# EAGLE design forTQFPAdapter (EAGLE 7.7.0)
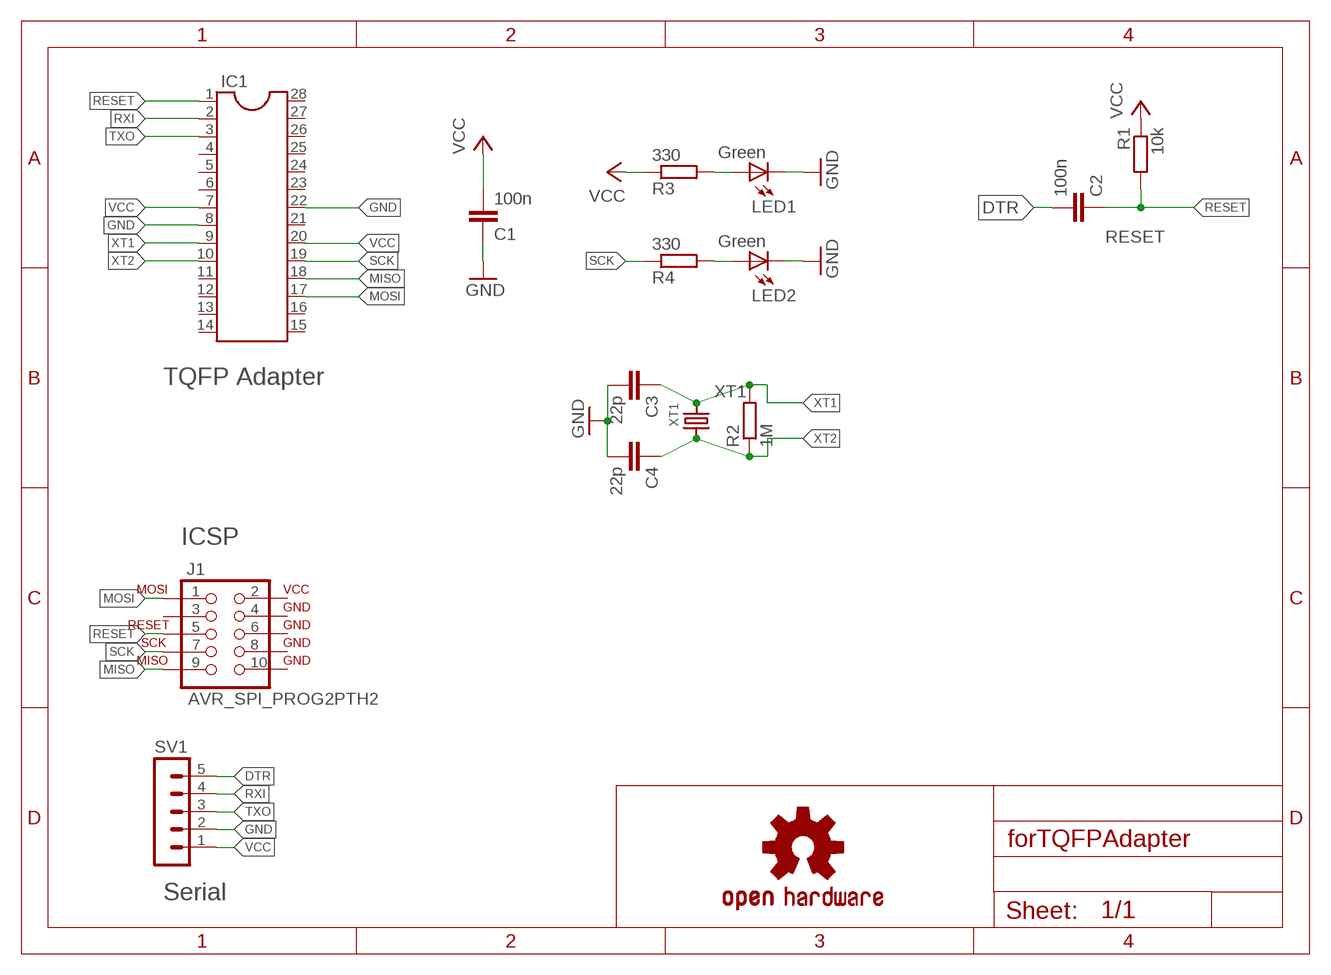
[diagram p0: schematic, sheet 1]

## Parts
C1  100n  C-EUC0805K  [C0805K]
C2  100n  C-EUC0805K  [C0805K]
C3  22p  C-EUC0805K  [C0805K]
C4  22p  C-EUC0805K  [C0805K]
IC1  DIL28  [DIL28-6]
J1  AVR_SPI_PROG2PTH2  [2X5-SHROUDED]
LED1  Green  LED1206  [LED-1206]
LED2  Green  LED1206  [LED-1206]
LOGO1  OSHW-LOGOM  [OSHW-LOGO-M]
R1  10k  R-EU_M0805  [M0805]
R2  1M  R-EU_M0805  [M0805]
R3  330  R-EU_M0805  [M0805]
R4  330  R-EU_M0805  [M0805]
SV1  MA05-1  [MA05-1]
XT1  CRYSTAL  [HC49]

## Nets
DTR: C2.2 SV1.5
GND: C1.1 C3.2 C4.2 IC1.8 IC1.22 LED1.C LED2.C SV1.2
MISO: IC1.18 J1.9(MISO)
MOSI: IC1.17 J1.1(MOSI)
N$1: LED2.A R4.2
N$7: LED1.A R3.2
RESET: C2.1 IC1.1 J1.5(RESET) R1.2
RXI: IC1.2 SV1.4
SCK: IC1.19 J1.7(SCK) R4.1
TXO: IC1.3 SV1.3
VCC: C1.2 IC1.7 IC1.20 R1.1 R3.1 SV1.1
XT1: C3.1 IC1.9 R2.2 XT1.11 XT1.12
XT2: C4.1 IC1.10 R2.1 XT1.21 XT1.22
Unconnected: IC1.4 IC1.5 IC1.6 IC1.11 IC1.12 IC1.13 IC1.14 IC1.15 IC1.16 IC1.21 IC1.23 IC1.24 IC1.25 IC1.26 IC1.27 IC1.28 J1.3(NC)

## Notes on the sheet
- TQFP Adapter
- ICSP
- Serial

## Power pins joined to a net without a drawn wire
GND: J1.4(GND) J1.6(GND) J1.8(GND) J1.10(GND)
VCC: J1.2(VCC)

## Library data of the parts
C1-C4 = rcl:C-EU: CAPACITOR, European symbol
IC1 = ic-package:DIL28: Dual In Line
J1 = SparkFun-Connectors:AVR_SPI_PROG2: AVR 10-pin ICSP Header This is the standard AVR In Circuit Serial Programming header. Minimal, but includes pin one indicator. Works with standard Olimex programmers. Also look for the 6-pin reduced version. Spark Fun Electronics SKU: PRT-00778
LED1 LED2 = Testing:LED: LEDs Standard schematic elements and footprints for 5mm, 3mm, 1206, and 0603 sized LEDs. 5mm - Spark Fun Electronics SKU : COM-00529 (and others)
LOGO1 = SparkFun-Aesthetics:OSHW-LOGO: Open-Source Hardware (OSHW) Logo This logo indicates the piece of hardware it is found on incorporates a OSHW license and/or adheres to the definition of open source hardware found here: http://freedomdefined.org/OSHW
R1-R4 = rcl:R-EU_: RESISTOR, European symbol
SV1 = con-lstb:MA05-1: PIN HEADER; OC_FARNELL: unknown; OC_NEWARK: unknown
XT1 = hazar:CRYSTAL: HC49 Crystal - SMD and through hole combined For providing assembly options

## Board
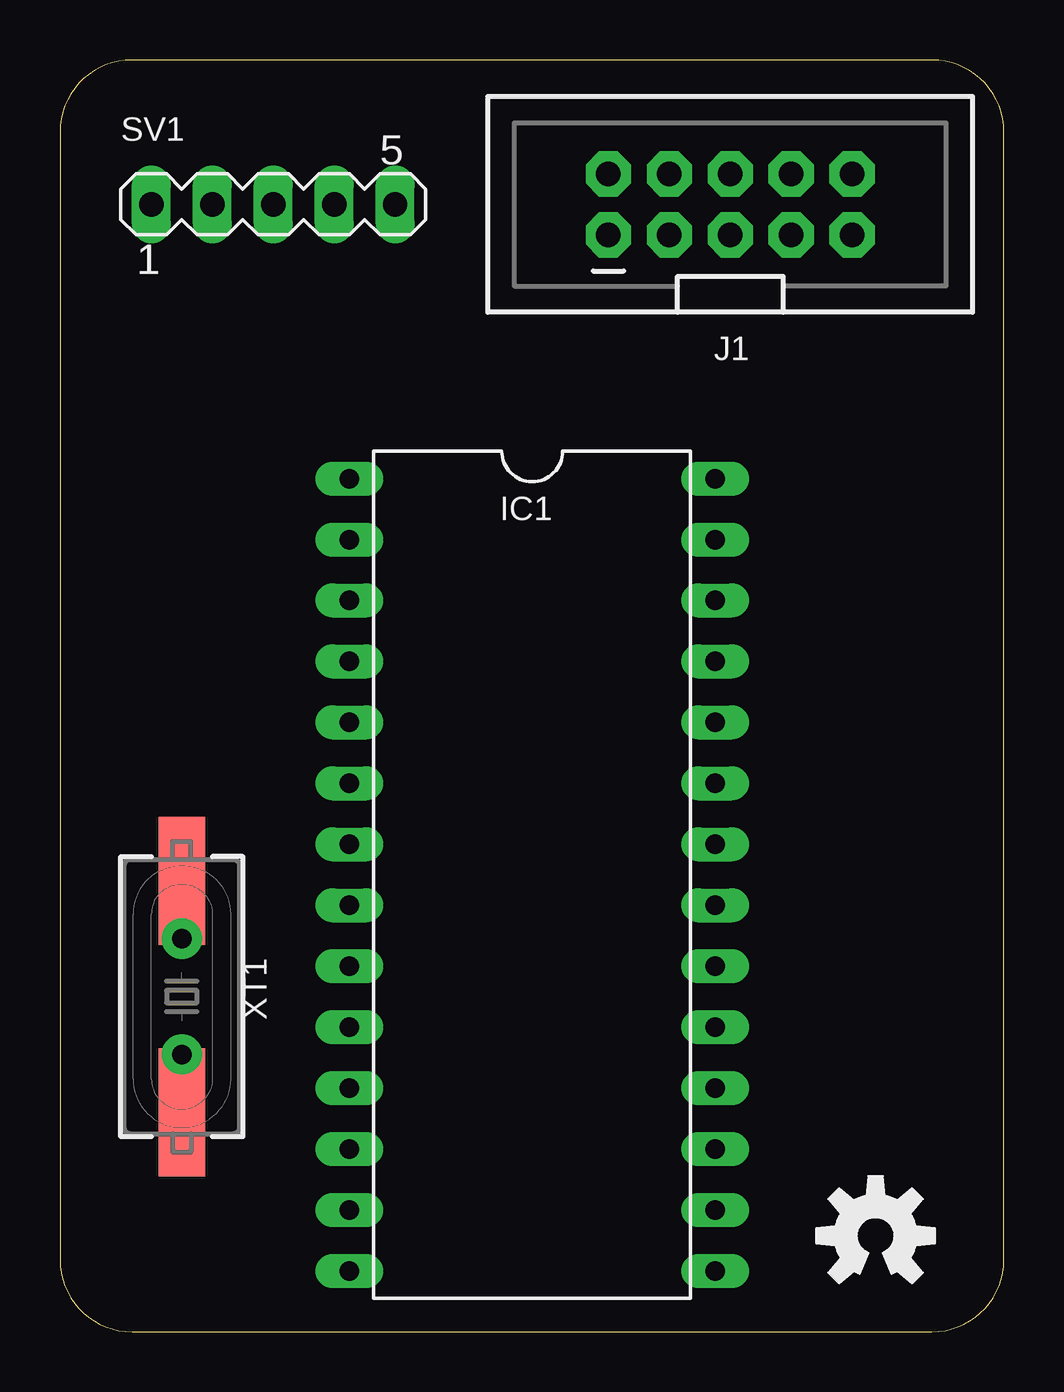
[diagram p1: board, top side]
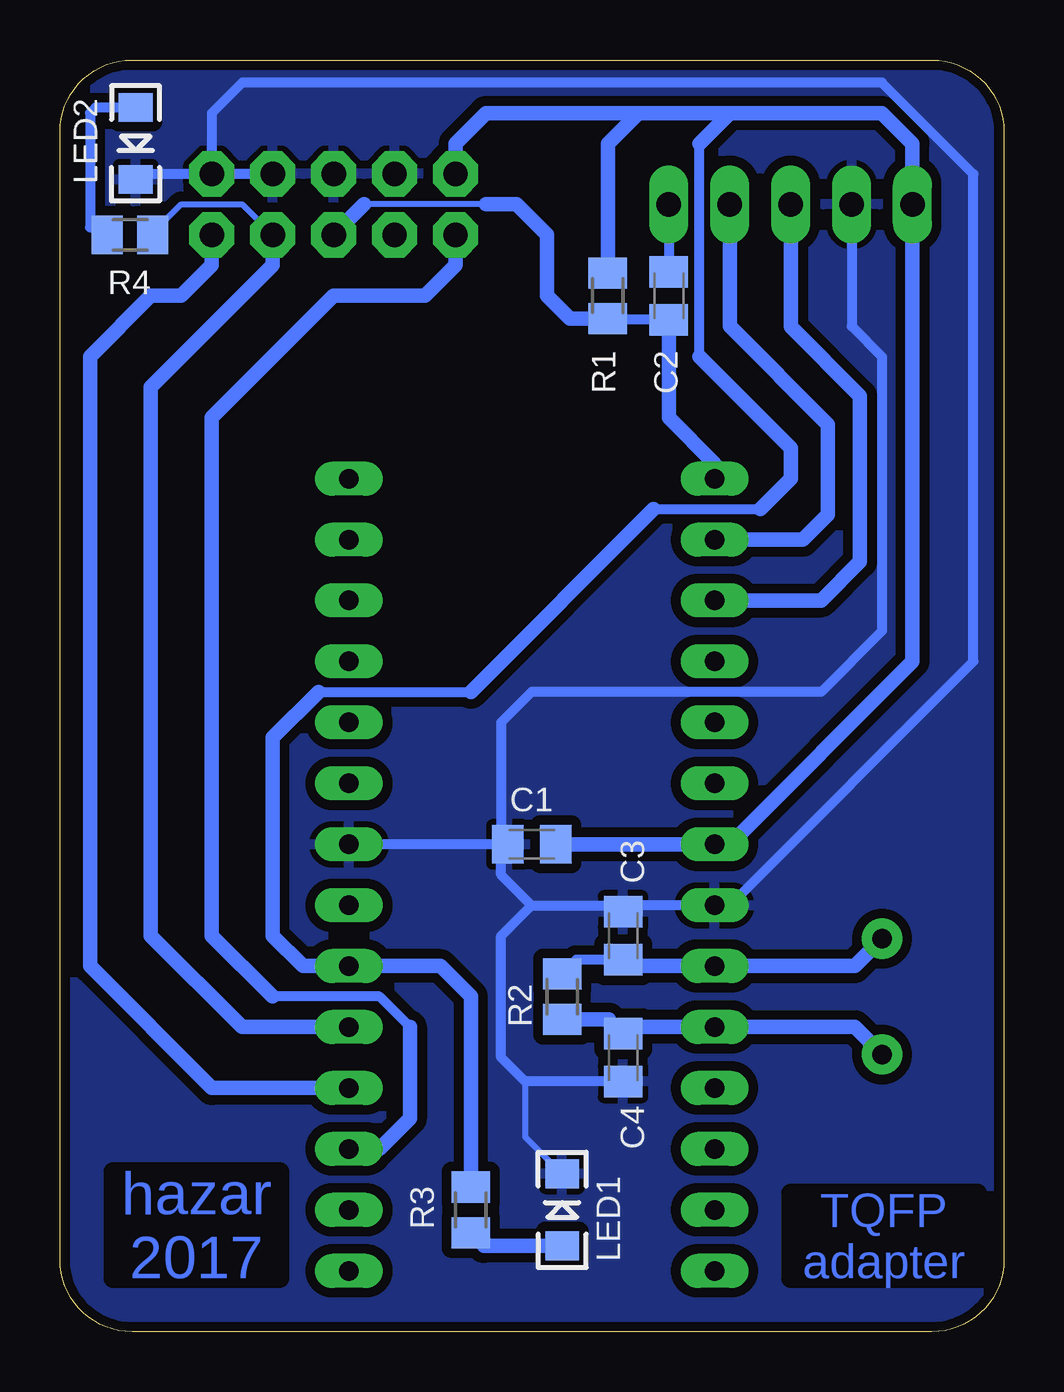
[diagram p2: board, bottom side, seen from below]

Size 39.35 x 53.01 mm. Coordinates in mm from the lower left corner, seen from the top.
Outline: 0,50.01 0,3 arc90 3,0 36.35,0 arc90 39.35,3 39.35,50.01 arc90 36.35,53.01 3,53.01 arc90 0,50.01
Copper layers (1*16): Top 0.035mm / dielectric 1.5mm / Bottom 0.035mm
Design rules "hazar": minimum track width 6mil, minimum drill 13mil, track to track 8mil, track to pad 8mil, pad to pad 8mil, via to via 8mil, smd to smd 8mil, copper to edge 15mil, drill to drill 8mil, minimum pad ring 12mil, minimum via ring 10mil, stop-mask expansion 4mil, vias tented up to drill 25mil, thermal gap 10mil

### Footprints (pad centres in the part's own frame; a part is rotated, then mirrored left to right if it is on the bottom)
C0805K = smd 1.3 x 1.6: 1 -1,0; 2 1,0
DIL28-6 = drill 0.813 long: 1 -16.51,-7.62; 2 -13.97,-7.62; 3 -11.43,-7.62; 4 -8.89,-7.62; 5 -6.35,-7.62; 6 -3.81,-7.62; 7 -1.27,-7.62; 8 1.27,-7.62; 9 3.81,-7.62; 10 6.35,-7.62; 11 8.89,-7.62; 12 11.43,-7.62; 13 13.97,-7.62; 14 16.51,-7.62; 15 16.51,7.62; 16 13.97,7.62; 17 11.43,7.62; 18 8.89,7.62; 19 6.35,7.62; 20 3.81,7.62; 21 1.27,7.62; 22 -1.27,7.62; 23 -3.81,7.62; 24 -6.35,7.62; 25 -8.89,7.62; 26 -11.43,7.62; 27 -13.97,7.62; 28 -16.51,7.62
2X5-SHROUDED = drill 1.016 pad 1.88 octagon: 1 -1.27,5.08; 2 1.27,5.08; 3 -1.27,2.54; 4 1.27,2.54; 5 -1.27,0; 6 1.27,0; 7 -1.27,-2.54; 8 1.27,-2.54; 9 -1.27,-5.08; 10 1.27,-5.08
LED-1206 = smd 1.2 x 1.4: A -1.5,0; C 1.5,0
M0805 = smd 1.3 x 1.6: 1 -0.95,0; 2 0.95,0
MA05-1 = drill 1.016 long: 1 -5.08,0; 2 -2.54,0; 3 0,0; 4 2.54,0; 5 5.08,0
HC49 = smd 5.334 x 1.93: 11 -4.826,0; 22 4.826,0 | drill 0.813 pad 1.676: 12 -2.413,0; 21 2.413,0

### Placement (x,y rotation side)
C1  19.68,20.32 0 bottom
C2  13.97,43.18 90 bottom
C3  15.88,16.51 90 bottom
C4  15.88,11.43 270 bottom
IC1  19.68,19.05 270 top
J1  27.94,46.99 90 top
LED1  18.41,5.08 90 bottom
LED2  36.2,49.53 270 bottom
LOGO1  34,4 0 top
R1  16.51,43.18 270 bottom
R2  18.41,13.97 90 bottom
R3  22.23,5.08 270 bottom
R4  36.43,45.72 180 bottom
SV1  8.89,46.99 0 top
XT1  5.08,13.97 270 top

### Tracks (layer width: path | path; a pad name or v marks a point on that pad's centre or on a via)
DTR
  Bottom 0.406: SV1.5 C2.2
GND
  Bottom 0.254: 19.95,10.43 19.95,8.12 LED1.C
  Bottom 0.406: C4.2 19.95,10.43 20.95,11.43 20.95,16.51 19.68,17.78 | 19.68,17.78 16.14,17.78 C3.2 15.61,17.78 IC1.8 11.43,17.78 1.27,27.94 1.27,48.26 5.08,52.07 31.75,52.07 33.02,50.8 J1.10 | C1.1 IC1.22 | 19.68,17.78 20.95,19.05 20.95,20.05 C1.1 | SV1.2 6.35,41.91 5.08,40.64 5.08,29.21 7.62,26.67 19.68,26.67 20.95,25.4 20.95,20.59 C1.1 | J1.8 J1.10 | J1.10 35.97,48.26 LED2.C
  pour Bottom (isolate 0.406): -1,54 41,54 41,-2 -1,-2
MISO
  Bottom 0.61: J1.9 33.02,44.45 34.29,43.18 35.56,43.18 38.1,40.64 38.1,15.24 33.02,10.16 IC1.18
MOSI
  Bottom 0.406: 24.77,12.7 26.04,13.97 30.48,13.97 | 26.04,7.62 IC1.17
  Bottom 0.61: J1.1 22.86,44.45 24.13,43.18 27.94,43.18 33.02,38.1 33.02,16.51 30.48,13.97 | 24.77,12.7 24.77,8.89 26.04,7.62
N$1
  Bottom 0.406: LED2.A 37.87,51.03 38.1,50.8 38.1,46.04 R4.2
N$7
  Bottom 0.254: 21.68,3.58 R3.2
  Bottom 0.61: LED1.A 21.68,3.58
RESET
  Bottom 0.254: 21.59,46.99 26.67,46.99
  Bottom 0.406: C2.1 16.46,42.18 R1.2
  Bottom 0.61: R1.2 18.1,42.23 19.05,43.18 19.05,45.72 20.32,46.99 21.59,46.99 | 26.67,46.99 J1.5 | IC1.1 12.06,36.2 13.97,38.1 C2.1
RXI
  Bottom 0.61: IC1.2 8.38,33.02 7.34,34.06 7.34,37.82 11.43,41.91 SV1.4
SCK
  Bottom 0.254: R4.1 35.56,45.72 34.29,46.99 31.75,46.99 J1.7
  Bottom 0.61: J1.7 30.48,44.45 35.56,39.37 35.56,16.51 31.75,12.7 IC1.19
TXO
  Bottom 0.61: IC1.3 7.62,30.48 6,32.1 6,39 8.89,41.89 8.89,41.91 SV1.3
VCC
  Bottom 0.254: 23.5,15.24 IC1.20
  Bottom 0.406: 28.57,26.67 22.23,26.67 | 12.7,40.64 12.7,49.53 | 14.61,34.29 10.16,34.29 | 11.43,20.32 IC1.7
  Bottom 0.61: 11.43,50.8 5.08,50.8 3.81,49.53 SV1.1 3.81,27.94 11.43,20.32 | 11.43,50.8 15.24,50.8 | 15.24,50.8 21.59,50.8 22.86,49.53 J1.2 | R1.1 16.51,49.53 15.24,50.8 | IC1.7 C1.2 | 22.23,26.67 14.61,34.29 | 12.7,49.53 11.43,50.8 | R3.1 22.23,13.97 23.5,15.24 29.21,15.24 30.48,16.51 30.48,24.77 28.57,26.67 | 10.16,34.29 8.89,35.56 8.89,36.83 12.7,40.64
XT1
  Top 0.406: XT1.12 XT1.11
  Bottom 0.406: 15.61,15.24 C3.1 17.82,15.51 R2.2
  Bottom 0.61: 15.61,15.24 IC1.9 6.22,15.24 XT1.12
XT2
  Top 0.406: XT1.21 XT1.22
  Bottom 0.406: 16.46,13.02 C4.1
  Bottom 0.61: C4.1 15.61,12.7 IC1.10 6.22,12.7 XT1.21 | R2.1 16.46,13.02

### Text on the board
Bottom: TQFP / adapter | hazar / 2017
tDocu: VCC / GND / TXO / RXI / DTR | ICSP